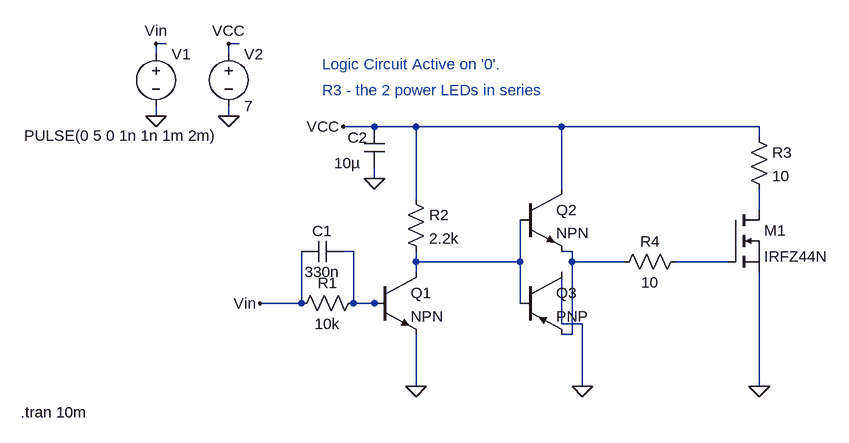
[diagram p0: schematic RC Car - The lights.asc]
RC Car - The lights.asc, the LTspice schematic file:
Version 4
SHEET 1 880 680
WIRE -448 16 -464 16
WIRE -336 16 -352 16
WIRE -464 32 -464 16
WIRE -352 32 -352 16
WIRE -464 128 -464 112
WIRE -352 128 -352 112
WIRE -128 144 -176 144
WIRE -64 144 -128 144
WIRE 160 144 -64 144
WIRE 464 144 160 144
WIRE 464 160 464 144
WIRE -128 224 -128 208
WIRE 160 240 160 144
WIRE -64 256 -64 144
WIRE 464 272 464 240
WIRE -160 336 -176 336
WIRE 176 336 160 336
WIRE -64 352 -64 336
WIRE 96 352 96 288
WIRE 96 352 -64 352
WIRE 176 352 176 336
WIRE 256 352 176 352
WIRE 416 352 336 352
WIRE -64 368 -64 352
WIRE -240 416 -240 336
WIRE -240 416 -304 416
WIRE -160 416 -160 336
WIRE -128 416 -160 416
WIRE -112 416 -128 416
WIRE 96 416 96 352
WIRE 160 448 160 368
WIRE 192 448 160 448
WIRE 176 464 176 352
WIRE 176 464 160 464
WIRE -64 544 -64 464
WIRE 192 544 192 448
WIRE 464 544 464 368
FLAG -464 128 0
FLAG -64 544 0
FLAG -352 128 0
FLAG 192 544 0
FLAG 464 544 0
FLAG -128 224 0
FLAG -352 16 VCC
FLAG -176 144 VCC
FLAG -464 16 Vin
FLAG -304 416 Vin
SYMBOL npn -128 368 R0
SYMATTR InstName Q1
SYMBOL npn 96 240 R0
SYMATTR InstName Q2
SYMBOL pnp 96 368 R0
SYMATTR InstName Q3
SYMBOL res -144 400 R90
WINDOW 0 0 56 VBottom 2
WINDOW 3 32 56 VTop 2
SYMATTR InstName R1
SYMATTR Value 10k
SYMBOL res -80 240 R0
SYMATTR InstName R2
SYMATTR Value 2.2k
SYMBOL res 448 144 R0
SYMATTR InstName R3
SYMATTR Value 10
SYMBOL res 352 336 R90
WINDOW 0 0 56 VBottom 2
WINDOW 3 32 56 VTop 2
SYMATTR InstName R4
SYMATTR Value 10
SYMBOL cap -176 320 R90
WINDOW 0 0 32 VBottom 2
WINDOW 3 32 32 VTop 2
SYMATTR InstName C1
SYMATTR Value 330n
SYMBOL voltage -464 16 R0
WINDOW 3 -203 142 Left 2
WINDOW 123 0 0 Left 0
WINDOW 39 0 0 Left 0
SYMATTR Value PULSE(0 5 0 1n 1n 1m 2m)
SYMATTR InstName V1
SYMBOL voltage -352 16 R0
WINDOW 123 0 0 Left 0
WINDOW 39 0 0 Left 0
SYMATTR InstName V2
SYMATTR Value 7
SYMBOL nmos 416 272 R0
SYMATTR InstName M1
SYMATTR Value IRFZ44N
SYMBOL cap -144 144 R0
WINDOW 0 -25 17 Left 2
WINDOW 3 -46 56 Left 2
SYMATTR InstName C2
SYMATTR Value 10µ
TEXT -672 584 Left 2 !.tran 10m
TEXT -208 48 Left 2 ;Logic Circuit Active on '0'.
TEXT -208 88 Left 2 ;R3 - the 2 power LEDs in series

The netlist it stands for:
* RC Car - The lights.asc
Q1 N004 N002 0 0 NPN
Q2 VCC N004 N003 0 NPN
Q3 0 N004 N003 0 PNP
R1 N002 Vin 10k
R2 VCC N004 2.2k
R3 VCC N001 10
R4 N005 N003 10
C1 N002 Vin 330n
V1 Vin 0 PULSE(0 5 0 1n 1n 1m 2m)
V2 VCC 0 7
M1 N001 N005 0 0 IRFZ44N
C2 VCC 0 10µ
.model NPN NPN
.model PNP PNP
.lib standard.bjt
.model NMOS NMOS
.model PMOS PMOS
.lib standard.mos
.tran 10m
* Logic Circuit Active on '0'.
* R3 - the 2 power LEDs in series
.backanno
.end